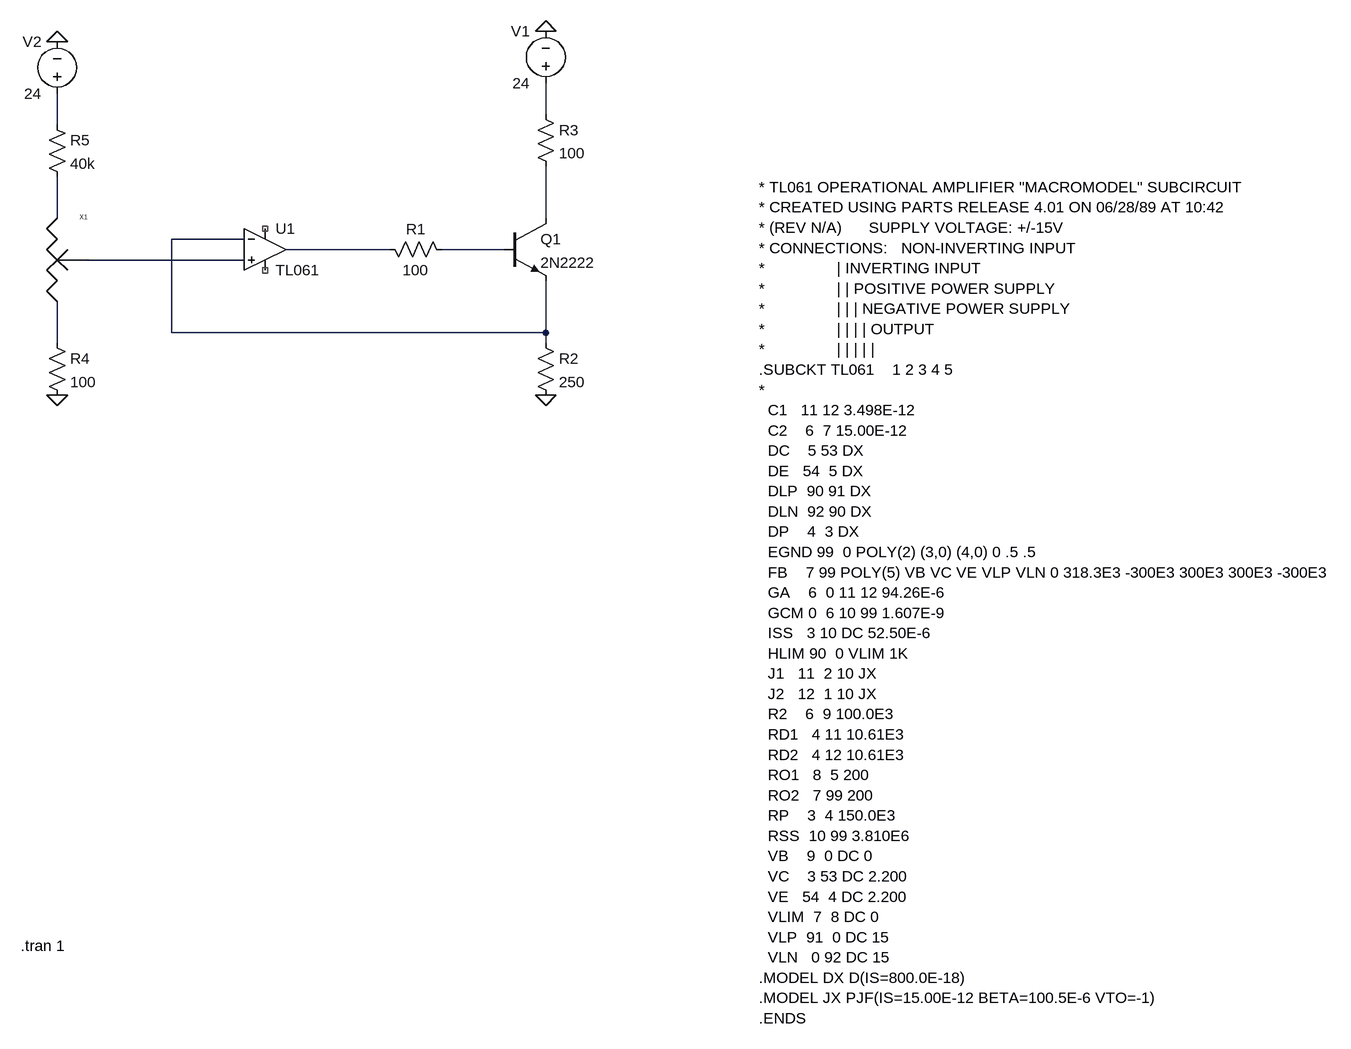
[diagram p0: schematic schemat1 (1).asc]
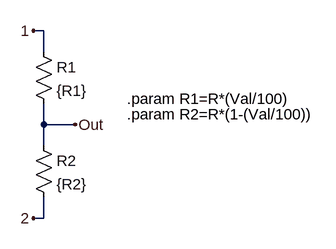
[diagram p1: sub-circuit potentiometer.asc]
schemat1 (1).asc, the LTspice schematic file:
Version 4
SHEET 1 1252 1280
WIRE 16 -16 16 -64
WIRE -736 0 -736 -48
WIRE -736 144 -736 80
WIRE 16 144 16 64
WIRE -448 176 -560 176
WIRE -224 192 -384 192
WIRE -48 192 -144 192
WIRE -448 208 -688 208
WIRE -560 320 -560 176
WIRE 16 320 16 240
WIRE 16 320 -560 320
WIRE -736 336 -736 272
WIRE 16 336 16 320
FLAG 16 416 0
FLAG 16 -144 0
FLAG -736 416 0
FLAG -736 -128 0
SYMBOL res -128 208 M270
WINDOW 0 32 56 VTop 2
WINDOW 3 0 56 VBottom 2
SYMATTR InstName R1
SYMATTR Value 100
SYMBOL res 0 320 R0
SYMATTR InstName R2
SYMATTR Value 250
SYMBOL res 0 -32 R0
SYMATTR InstName R3
SYMATTR Value 100
SYMBOL OpAmps\\opamp2 -416 128 R0
SYMATTR InstName U1
SYMATTR Value TL061
SYMBOL npn -48 144 R0
SYMATTR InstName Q1
SYMATTR Value 2N2222
SYMBOL voltage 16 -48 R180
WINDOW 0 24 96 Left 2
WINDOW 3 24 16 Left 2
WINDOW 123 0 0 Left 0
WINDOW 39 0 0 Left 0
SYMATTR InstName V1
SYMATTR Value 24
SYMBOL voltage -736 -32 R180
WINDOW 0 24 96 Left 2
WINDOW 3 24 16 Left 2
WINDOW 123 0 0 Left 0
WINDOW 39 0 0 Left 0
SYMATTR InstName V2
SYMATTR Value 24
SYMBOL Potentiometer -736 208 R0
SYMATTR InstName X1
SYMBOL res -752 320 R0
SYMATTR InstName R4
SYMATTR Value 100
SYMBOL res -752 -16 R0
SYMATTR InstName R5
SYMATTR Value 40k
TEXT 344 96 Left 2 !* TL061 OPERATIONAL AMPLIFIER "MACROMODEL" SUBCIRCUIT\n* CREATED USING PARTS RELEASE 4.01 ON 06/28/89 AT 10:42\n* (REV N/A)      SUPPLY VOLTAGE: +/-15V\n* CONNECTIONS:   NON-INVERTING INPUT\n*                | INVERTING INPUT\n*                | | POSITIVE POWER SUPPLY\n*                | | | NEGATIVE POWER SUPPLY\n*                | | | | OUTPUT\n*                | | | | |\n.SUBCKT TL061    1 2 3 4 5\n*\n  C1   11 12 3.498E-12\n  C2    6  7 15.00E-12\n  DC    5 53 DX\n  DE   54  5 DX\n  DLP  90 91 DX\n  DLN  92 90 DX\n  DP    4  3 DX\n  EGND 99  0 POLY(2) (3,0) (4,0) 0 .5 .5\n  FB    7 99 POLY(5) VB VC VE VLP VLN 0 318.3E3 -300E3 300E3 300E3 -300E3\n  GA    6  0 11 12 94.26E-6\n  GCM 0  6 10 99 1.607E-9\n  ISS   3 10 DC 52.50E-6\n  HLIM 90  0 VLIM 1K\n  J1   11  2 10 JX\n  J2   12  1 10 JX\n  R2    6  9 100.0E3\n  RD1   4 11 10.61E3\n  RD2   4 12 10.61E3\n  RO1   8  5 200\n  RO2   7 99 200\n  RP    3  4 150.0E3\n  RSS  10 99 3.810E6\n  VB    9  0 DC 0\n  VC    3 53 DC 2.200\n  VE   54  4 DC 2.200\n  VLIM  7  8 DC 0\n  VLP  91  0 DC 15\n  VLN   0 92 DC 15\n.MODEL DX D(IS=800.0E-18)\n.MODEL JX PJF(IS=15.00E-12 BETA=100.5E-6 VTO=-1)\n.ENDS
TEXT -792 1264 Left 2 !.tran 1

potentiometer.asc, the sub-circuit schematic file:
Version 4
SHEET 1 880 680
WIRE 144 16 128 16
WIRE 144 48 144 16
WIRE 144 160 144 128
WIRE 192 160 144 160
WIRE 144 192 144 160
WIRE 144 304 144 272
WIRE 144 304 128 304
FLAG 128 16 1
FLAG 128 304 2
FLAG 192 160 Out
SYMBOL res 128 32 R0
SYMATTR InstName R1
SYMATTR Value {R1}
SYMBOL res 128 176 R0
SYMATTR InstName R2
SYMATTR Value {R2}
TEXT 272 120 Left 2 !.param R1=R*(Val/100)
TEXT 272 144 Left 2 !.param R2=R*(1-(Val/100))

The netlist it stands for:
* schemat1 (1).asc
R1 N007 N006 100
R2 N005 0 250
R3 N001 N004 100
XU1 N008 N005 NC_01 NC_02 N006 TL061  ; pins In+ In- V+ V- OUT
Q1 N004 N007 N005 0 2N2222
V1 N001 0 24
V2 N002 0 24
XX1 N003 N009 N008 potentiometer params: R=10k,Val=50
R4 N009 0 100
R5 N002 N003 40k

* block symbol definitions
.subckt potentiometer 1 2 Out
R1 1 Out {R1}
R2 Out 2 {R2}
.param R1=R*(Val/100)
.param R2=R*(1-(Val/100))
.ends potentiometer

.model NPN NPN
.model PNP PNP
.lib standard.bjt
* TL061 OPERATIONAL AMPLIFIER "MACROMODEL" SUBCIRCUIT
* CREATED USING PARTS RELEASE 4.01 ON 06/28/89 AT 10:42
* (REV N/A)      SUPPLY VOLTAGE: +/-15V
* CONNECTIONS:   NON-INVERTING INPUT
*                | INVERTING INPUT
*                | | POSITIVE POWER SUPPLY
*                | | | NEGATIVE POWER SUPPLY
*                | | | | OUTPUT
*                | | | | |
.SUBCKT TL061    1 2 3 4 5
*
  C1   11 12 3.498E-12
  C2    6  7 15.00E-12
  DC    5 53 DX
  DE   54  5 DX
  DLP  90 91 DX
  DLN  92 90 DX
  DP    4  3 DX
  EGND 99  0 POLY(2) (3,0) (4,0) 0 .5 .5
  FB    7 99 POLY(5) VB VC VE VLP VLN 0 318.3E3 -300E3 300E3 300E3 -300E3
  GA    6  0 11 12 94.26E-6
  GCM 0  6 10 99 1.607E-9
  ISS   3 10 DC 52.50E-6
  HLIM 90  0 VLIM 1K
  J1   11  2 10 JX
  J2   12  1 10 JX
  R2    6  9 100.0E3
  RD1   4 11 10.61E3
  RD2   4 12 10.61E3
  RO1   8  5 200
  RO2   7 99 200
  RP    3  4 150.0E3
  RSS  10 99 3.810E6
  VB    9  0 DC 0
  VC    3 53 DC 2.200
  VE   54  4 DC 2.200
  VLIM  7  8 DC 0
  VLP  91  0 DC 15
  VLN   0 92 DC 15
.MODEL DX D(IS=800.0E-18)
.MODEL JX PJF(IS=15.00E-12 BETA=100.5E-6 VTO=-1)
.ENDS
.tran 1
.backanno
.end